# Altium schematic sheet BMS.SchDoc
size A4; SheetNumber: 1; SheetTotal: 2
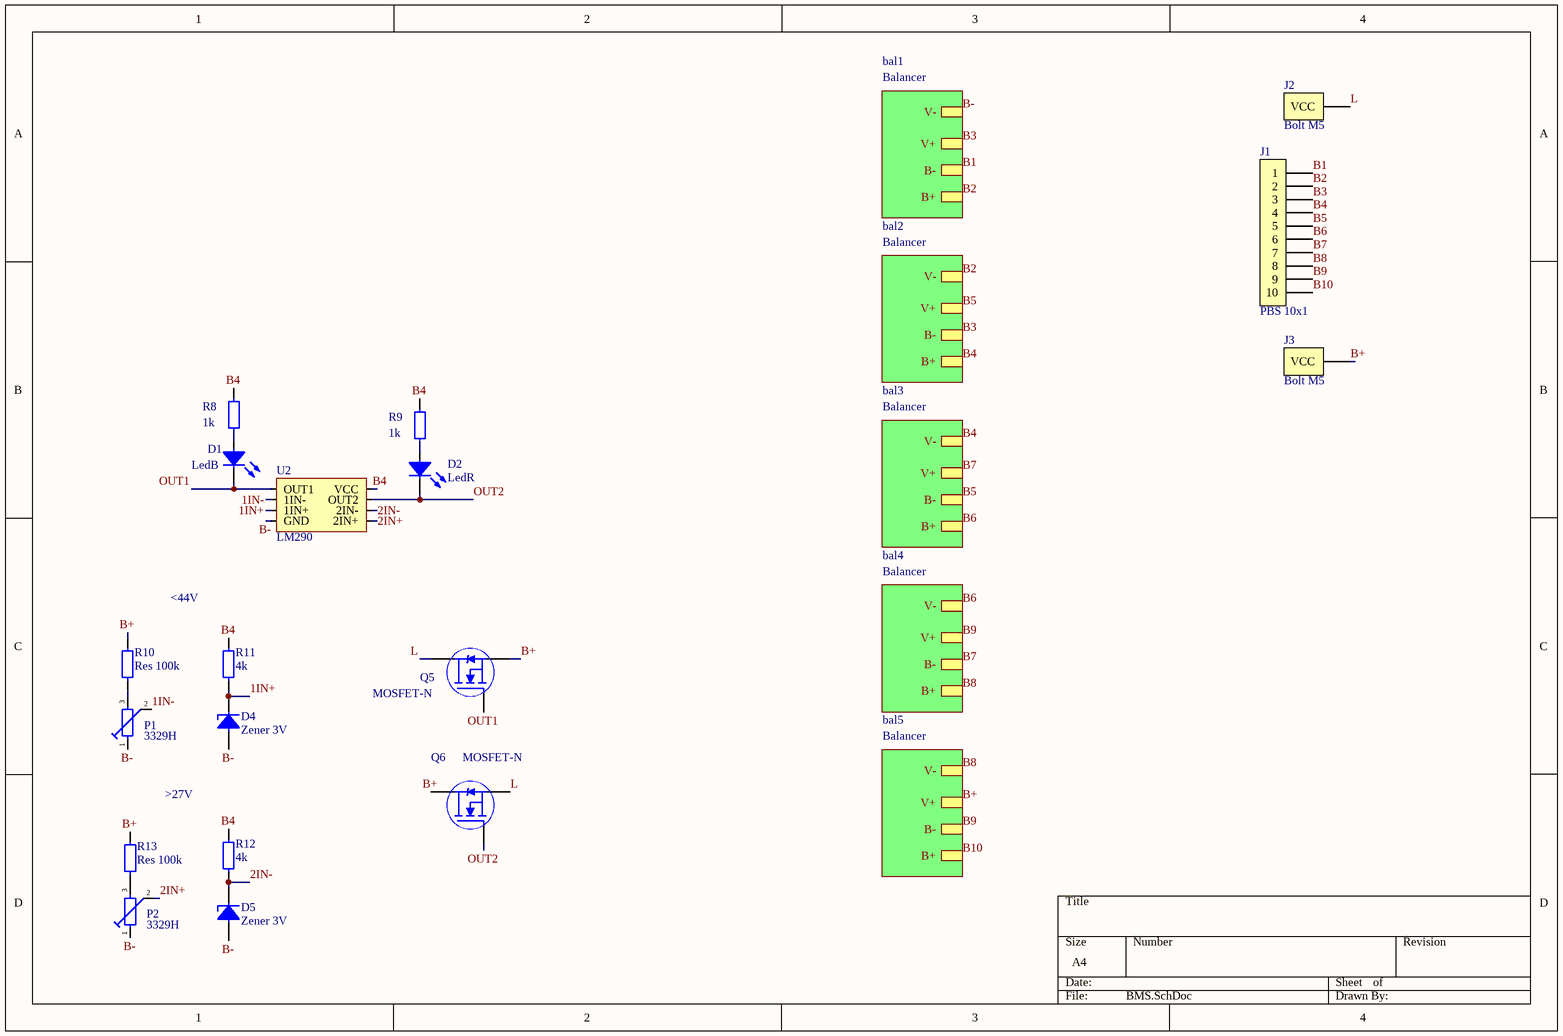
[diagram p0: BMS.SchDoc]

## Parts
D1  LedB  [0805 LED]
D2  LedR  [0805 LED]
D4  Zener 3V  [sod-123]
D5  Zener 3V  [sod-123]
J1  PBS 10x1  [PBS10]
J2  Bolt M5  [Bolt M5]
J3  Bolt M5  [Bolt M5]
P1  3329H  [3329H]
P2  3329H  [3329H]
Q5  MOSFET-N  [D-Pak (TO-252AA)]
Q6  MOSFET-N  [D-Pak (TO-252AA)]
R8  1k  [0805 Resistor]
R9  1k  [0805 Resistor]
R10  Res 100k  [0805 Resistor]
R11  4k  [0805 Resistor]
R12  4k  [0805 Resistor]
R13  Res 100k  [0805 Resistor]
U2  LM290  [SOIC-8]

## Sub-sheets
bal1 = Balancer: V-, V+, B-, B+
bal2 = Balancer: V-, V+, B-, B+
bal3 = Balancer: V-, V+, B-, B+
bal4 = Balancer: V-, V+, B-, B+
bal5 = Balancer: V-, V+, B-, B+

## Nets
1IN+: D4.2 R11.1 U2.3(1IN+)
1IN-: P1.2 U2.2(1IN-)
2IN+: P2.2 U2.5(2IN+)
2IN-: D5.2 R12.1 U2.6(2IN-)
B1: J1.1 ; sheet bal1/B-
B2: J1.2 ; sheet bal1/B+, sheet bal2/V-
B3: J1.3 ; sheet bal1/V+, sheet bal2/B-
B4: J1.4 R8.2 R9.2 R11.2 R12.2 U2.8(VCC) ; sheet bal2/B+, sheet bal3/V-
B5: J1.5 ; sheet bal2/V+, sheet bal3/B-
B6: J1.6 ; sheet bal3/B+, sheet bal4/V-
B7: J1.7 ; sheet bal3/V+, sheet bal4/B-
B8: J1.8 ; sheet bal4/B+, sheet bal5/V-
B9: J1.9 ; sheet bal4/V+, sheet bal5/B-
B10: J1.10 ; sheet bal5/B+
B+: J3.1(VCC) Q5.3(Source) Q6.2(Drain) R10.2 R13.2 ; sheet bal5/V+
B-: D4.1 D5.1 P1.1 P2.1 U2.4(GND) ; sheet bal1/V-
L: J2.1(VCC) Q5.2(Drain) Q6.3(Source)
OUT1: D1.2 Q5.1(Gate) U2.1(OUT1)
OUT2: D2.2 Q6.1(Gate) U2.7(OUT2)
NetD1_1: D1.1 R8.1
NetD2_1: D2.1 R9.1
NetP1_3: P1.3 R10.1
NetP2_3: P2.3 R13.1

## Notes on the sheet
- <44V
- >27V

## Library data of the parts
D1 = Led Yellow: SMD 1608, 247mcd, 120°, 592nM (High Bright Yellow); Part Number: TO-1608BC-MYF; Manufacturer: Taiwan Oasis Technology; Type: Diode; ComponentLink1Description: Chip&Dip; ComponentLink1URL: https://www.chipdip.ru/product/gnl-0603ubc
D2 = Led Red: SMD 1608, 112mcd, 120°, 630nM (Ultra Bright Red); Part Number: TO-1608BC-MRE; Manufacturer: Taiwan Oasis Technology; Type: Diode; ComponentLink1Description: Chip&Dip; ComponentLink1URL: https://www.chipdip.ru/product/to-1608bc-mre
D4 D5 = Zener Diode 3V: 500mW; Part Number: MMSZ5225B; Manufacturer: Yangzhou Yangjie Electronic Technology; Type: Diode; ComponentLink1Description: Chip&Dip; ComponentLink1URL: https://www.chipdip.ru/product/mmsz5225b; ComponentLink2Description: DataSheet; ComponentLink2URL: https://static.chipdip.ru/lib/152/DOC001152772.pdf
J1 = Conn 10 (PBS): Female; Part Number: DS1023-1*10S21; Manufacturer: Ningbo connfly electronic; Type: Connector; ComponentLink1Description: Chip&Dip; ComponentLink1URL: https://www.chipdip.ru/product/pbs-10r
J2 J3 = Conn Bolt M5: Bolt M5 high corrent connector; Type: Connetctor; Manufacturer: *; Part Number: *; ComponentLink1Description: Chip&Dip; ComponentLink1URL: *; ComponentLink2Description: Datasheet; ComponentLink2URL: *
P1 P2 = Pot 15k: Potentiometr 15k 0.5W; Part Number: M64X203KB40; Manufacturer: Vishay; ComponentLink2Description: Datasheet; ComponentLink2URL: https://static.chipdip.ru/lib/250/DOC000250619.pdf; Type: Potentiometer
Q5 Q6 = MOSFET-N [IRLR]: Trans MOSFET N-CH Si 55V 89A 3-Pin(2+Tab) DPAK Tube; Part Number: IRLR3705ZTRPBF; Manufacturer: International Rectifier; Type: Transistor; ComponentLink1Description: DataSheet; ComponentLink1URL: https://static.chipdip.ru/lib/292/DOC000292789.pdf; ComponentLink2Description: Chip&Dip; ComponentLink2URL: https://www.chipdip.ru/product/irlr3705zpbf
R8 R9 = Res 3.9k (0805): 0.125W 0805 3.9k, 1%; Part Number: RC0805FR-073K9L; Manufacturer: Taiwan; Type: Resistor; ComponentLink1Description: Chip&Dip; ComponentLink1URL: https://www.chipdip.ru/product0/9000079500
R10 R13 = Res 100k (0805): 0.125W 0805 100k, 1%; Part Number: RC0805FR-07100KL; Manufacturer: Taiwan; Type: Resistor; ComponentLink1Description: Chip&Dip; ComponentLink1URL: https://www.chipdip.ru/product0/9000079538
R11 R12 = Res 6.8k (0805): 0.125W 0805 6.8k, 1%; Part Number: RC0805FR-076K8L; Manufacturer: Taiwan; Type: Resistor; ComponentLink1Description: Chip&Dip; ComponentLink1URL: https://www.chipdip.ru/product0/9000079506
U2 = Comp 2x: LM290 SOIC-8; ComponentLink1Description: DataSheet; ComponentLink1URL: https://static.chipdip.ru/lib/938/DOC011938774.pdf; ComponentLink2Description: ChipDip; ComponentLink2URL: https://www.chipdip.ru/product/lm2903d-stm